# Altium schematic sheet microcontroller_common.SchDoc
size A
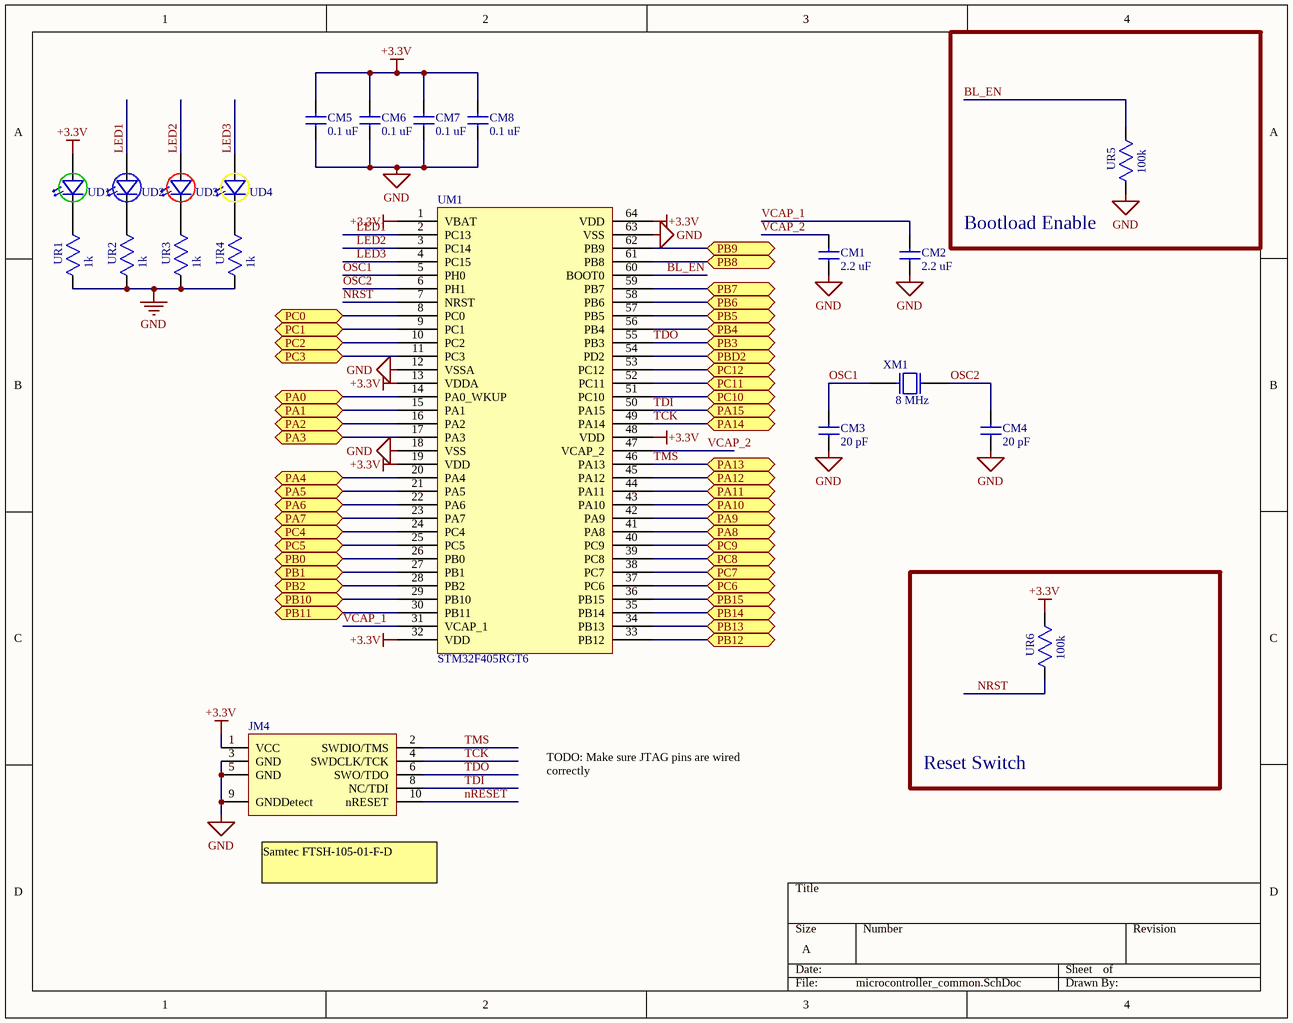
[diagram p0: microcontroller_common.SchDoc]

## Parts
CM1  value 2.2 uF  [0805_Capacitor]  (hidden comment: CAP 2.2 uF)
CM2  value 2.2 uF  [0805_Capacitor]  (hidden comment: CAP 2.2 uF)
CM3  value 20 pF  [0805_Capacitor]  (hidden comment: CAP 20PF)
CM4  value 20 pF  [0805_Capacitor]  (hidden comment: CAP 20PF)
CM5  value 0.1 uF  [0805_Capacitor]  (hidden comment: CAP 0.1uF)
CM6  value 0.1 uF  [0805_Capacitor]  (hidden comment: CAP 0.1uF)
CM7  value 0.1 uF  [0805_Capacitor]  (hidden comment: CAP 0.1uF)
CM8  value 0.1 uF  [0805_Capacitor]  (hidden comment: CAP 0.1uF)
JM4  J_CORTEX_DEBUG  [CORTEX_DEBUG]  (value not drawn)
UD1  D_LED_0805_GREEN  [0805P_Green]  (value not drawn)
UD2  D_LED_0805_BLUE  [0805_BLUE]  (value not drawn)
UD3  D_LED_0805_RED  [0805P_RED]  (value not drawn)
UD4  D_LED_0805_YELLOW  [0805P_YELLOW]  (value not drawn)
UM1  STM32F405RGT6  [STM32_LQFP64]
UR1  value 1k  [0805_Resistor]  (hidden comment: R_0805_1k)
UR2  value 1k  [0805_Resistor]  (hidden comment: R_0805_1k)
UR3  value 1k  [0805_Resistor]  (hidden comment: R_0805_1k)
UR4  value 1k  [0805_Resistor]  (hidden comment: R_0805_1k)
UR5  value 100k  [0805_Resistor]  (hidden comment: R_0805_100k_1%)
UR6  value 100k  [0805_Resistor]  (hidden comment: R_0805_100k_1%)
XM1  value 8 MHz  [HC-49]  (hidden comment: HC49)

## Blocks framed on the sheet
Bootload Enable: UR5
Reset Switch: UR6

## Ports
PA0, PA1, PA2, PA3, PA4, PA5, PA6, PA7, PA8, PA9, PA10, PA11, PA12, PA13, PA14, PA15, PB0, PB1, PB2, PB3, PB4, PB5, PB6, PB7, PB8, PB9, PB10, PB11, PB12, PB13, PB14, PB15, PBD2, PC0, PC1, PC2, PC3, PC4, PC5, PC6, PC7, PC8, PC9, PC10, PC11, PC12

## Nets
+3.3V: CM5.1 CM6.1 CM7.1 CM8.1 JM4.1(VCC) UD1.2(Anode) UM1.1(VBAT) UM1.13(VDDA) UM1.19(VDD) UM1.32(VDD) UM1.48(VDD) UM1.64(VDD) UR6.1
GND: CM1.2 CM2.2 CM3.2 CM4.2 CM5.2 CM6.2 CM7.2 CM8.2 JM4.3(GND) JM4.5(GND) JM4.9(GNDDetect) UM1.12(VSSA) UM1.18(VSS) UM1.63(VSS) UR1.2 UR2.2 UR3.2 UR4.2 UR5.2
BL_EN: UM1.60(BOOT0) UR5.1
LED1: UD2.2(Anode) UM1.2(PC13)
LED2: UD3.2(Anode) UM1.3(PC14)
LED3: UD4.2(Anode) UM1.4(PC15)
nRESET: JM4.10(nRESET)
NRST: UM1.7(NRST) UR6.2
OSC1: CM3.1 UM1.5(PH0) XM1.1
OSC2: CM4.1 UM1.6(PH1) XM1.2
PA0: UM1.14(PA0_WKUP) ; port PA0
PA1: UM1.15(PA1) ; port PA1
PA2: UM1.16(PA2) ; port PA2
PA3: UM1.17(PA3) ; port PA3
PA4: UM1.20(PA4) ; port PA4
PA5: UM1.21(PA5) ; port PA5
PA6: UM1.22(PA6) ; port PA6
PA7: UM1.23(PA7) ; port PA7
PA8: UM1.41(PA8) ; port PA8
PA9: UM1.42(PA9) ; port PA9
PA10: UM1.43(PA10) ; port PA10
PA11: UM1.44(PA11) ; port PA11
PA12: UM1.45(PA12) ; port PA12
PB0: UM1.26(PB0) ; port PB0
PB1: UM1.27(PB1) ; port PB1
PB2: UM1.28(PB2) ; port PB2
PB4: UM1.56(PB4) ; port PB4
PB5: UM1.57(PB5) ; port PB5
PB6: UM1.58(PB6) ; port PB6
PB7: UM1.59(PB7) ; port PB7
PB8: UM1.61(PB8) ; port PB8
PB9: UM1.62(PB9) ; port PB9
PB10: UM1.29(PB10) ; port PB10
PB11: UM1.30(PB11) ; port PB11
PB12: UM1.33(PB12) ; port PB12
PB13: UM1.34(PB13) ; port PB13
PB14: UM1.35(PB14) ; port PB14
PB15: UM1.36(PB15) ; port PB15
PBD2: UM1.54(PD2) ; port PBD2
PC0: UM1.8(PC0) ; port PC0
PC1: UM1.9(PC1) ; port PC1
PC2: UM1.10(PC2) ; port PC2
PC3: UM1.11(PC3) ; port PC3
PC4: UM1.24(PC4) ; port PC4
PC5: UM1.25(PC5) ; port PC5
PC6: UM1.37(PC6) ; port PC6
PC7: UM1.38(PC7) ; port PC7
PC8: UM1.39(PC8) ; port PC8
PC9: UM1.40(PC9) ; port PC9
PC10: UM1.51(PC10) ; port PC10
PC11: UM1.52(PC11) ; port PC11
PC12: UM1.53(PC12) ; port PC12
TCK: JM4.4(SWDCLK/TCK) UM1.49(PA14) ; port PA14
TDI: JM4.8(NC/TDI) UM1.50(PA15) ; port PA15
TDO: JM4.6(SWO/TDO) UM1.55(PB3) ; port PB3
TMS: JM4.2(SWDIO/TMS) UM1.46(PA13) ; port PA13
VCAP_1: CM2.1 UM1.31(VCAP_1)
VCAP_2: CM1.1 UM1.47(VCAP_2)
NetUD1_1: UD1.1(Cathode) UR1.1
NetUD2_1: UD2.1(Cathode) UR2.1
NetUD3_1: UD3.1(Cathode) UR3.1
NetUD4_1: UD4.1(Cathode) UR4.1

## Notes on the sheet
- TODO: Make sure JTAG pins are wired correctly
- (near JM4) Samtec FTSH-105-01-F-D

## Library data of the parts
CM1 CM2 = C_0805_2.2uF: CAP CERM 2.2 uF; Package: 0805; Known Distributors: Digikey; ComponentLink1Description: Datasheet; ComponentLink1URL: SVN Datasheet URL
CM3 CM4 = C_0805_20PF_100V_5%: CAP CERM 20PF 5% 100V NP0 0805; Manufacturer: AVX; Manufacturer PN: 08051A200JAT2A; SVP Creator: Jonathan Nutzmann; Package: 0805; Known Distributors: Digikey; ComponentLink1Description: Datasheet; ComponentLink1URL: SVN Datasheet URL; Price: 0.231
CM5-CM8 = C_0805_0.1uF: CAP CERM 0.1uF; Manufacturer: Yageo; Manufacturer PN: CC0805ZRY5V9BB104; SVP Creator: Brett Paulsen; Package: 0805; Known Distributors: Digikey; ComponentLink1Description: Datasheet; ComponentLink1URL: SVN Datasheet URL; Price: .028
JM4 = J_CORTEX_DEBUG: CORTEX JTAG DEBUG CONNECTOR
UD1 = D_LED_0805_GREEN: LED CHIPLED 570NM GREEN 0805 SMD; Manufacturer: Osram Opto Semiconductors Inc; Manufacturer PN: LG R971-KN-1-0-20-R18; SVP Creator: Nate Bolyard; SVP Reviewer 1: Trevtron; Current: 20mA; Forward Voltage: 2.2V; Package: 0805; Known Distributors: Digikey; Value: GREEN; HelpURL: http://umnsvp.dyndns.org/svn/centaurus2/datasheets/common parts/LG_R971.pdf; ComponentLink1URL: http://umnsvp.dyndns.org/svn/centaurus2/datasheets/common parts/LG_R971.pdf; ComponentLink1Description: Datasheet
UD2 = D_LED_0805_BLUE: LED 2X1.2MM 470NM BL WTR CLR SMD; SVP Creator: Jonathan Nutzmann; Current: 20mA; Forward Voltage: 3.3; Value: RED; Package: 0805; Known Distributors: Digikey; ComponentLink1Description: Datasheet
UD3 = D_LED_0805_RED: LED CHIPLED 645NM RED DIFF 0805; SVP Creator: Jonathan Nutzmann; Current: 20mA; Forward Voltage: 1.8; Package: 0805; Known Distributors: Digikey; Value: RED; ComponentLink1Description: Datasheet
UD4 = D_LED_0805_YELLOW: LED 595NM AMBER DIFF SMD 0805; SVP Creator: Jonathan Nutzmann; Current: 20mA; Forward Voltage: 1.9; Value: YELLOW; Package: 0805; Known Distributors: Digikey; ComponentLink1Description: Datasheet
UM1 = U_STM32F405RGT6: IC MCU 32BIT 1MB FLASH 64LQFP; Manufacturer: STMicroelectronics; Part Number: STM32F405RGT6
UR1-UR4 = R_0805_1K_1%: RES 1K OHM 1/8W 1% 0805 SMD; Power Rating: .125W; SVP Creator: Katie Moenkhaus; Package: 0805; Known Distributor: Digikey; ComponentLink1Description: Datasheet
UR5 UR6 = R_0805_100k_1%: RES 100K OHM 1/8W 1% 0805 SMD; Manufacturer: Rohm Semiconductor; Power Rating: .125W; SVP Creator: Jonathan Nutzmann; Package: 0805; Known Distributor: Digikey; ComponentLink1Description: Datasheet
XM1 = X_HC49: CRYSTAL 8.00 MHZ 20PF 49US; Manufacturer: ECS; Manufacturer PN: ECS-80-20-4X; SVP Creator: Jonathan Nutzmann; Load Capacitance: 20pF; Known Distributor: Digikey; Package: HC49/US; ComponentLink1Description: Datasheet